# Altium schematic sheet Sheet2.SchDoc
size A1; SheetNumber: 1; SheetTotal: 1
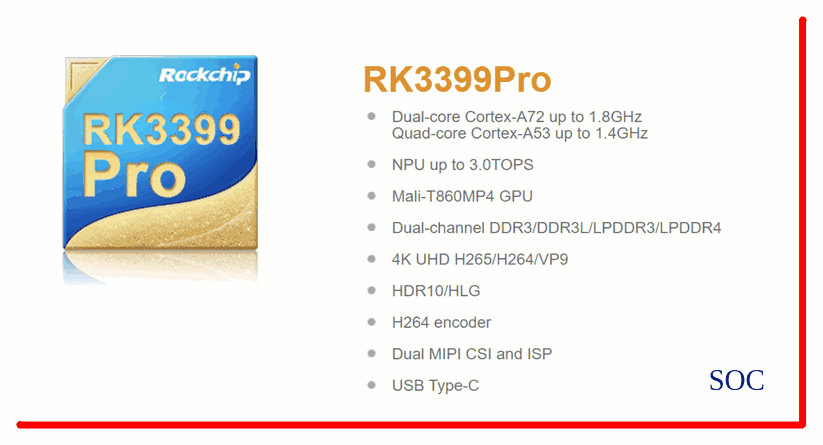
[diagram p0: Sheet2.SchDoc]

## Notes on the sheet
- SOC